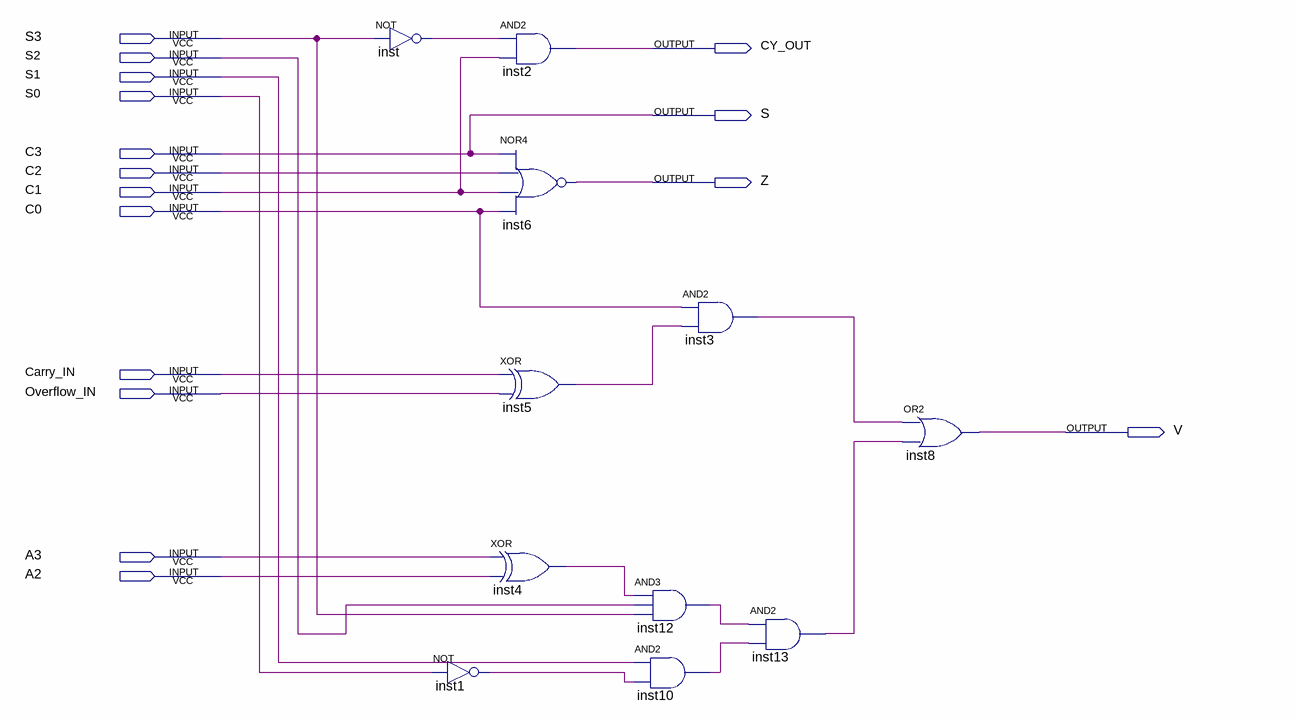
[diagram p0: schematic sheet]
// Quartus schematic Lab3.bdf as structural Verilog: 11 symbols, 16 pins
module Lab3 (
  input  S3,
  input  S2,
  input  S1,
  input  S0,
  input  C3,
  input  C2,
  input  C1,
  input  C0,
  input  Carry_IN,
  input  Overflow_IN,
  input  A3,
  input  A2,
  output CY_OUT,
  output S,
  output Z,
  output V
);

  wire inst1_out, inst3_out, inst4_out, inst5_out, inst10_out, inst12_out, inst13_out, inst_out;

  not inst (inst_out, S3);
  not inst1 (inst1_out, S0);
  and inst2 (CY_OUT, inst_out, C1);
  nor inst6 (Z, C3, C2, C1, C0);
  xor inst5 (inst5_out, Carry_IN, Overflow_IN);
  xor inst4 (inst4_out, A3, A2);
  and inst3 (inst3_out, C0, inst5_out);
  and inst12 (inst12_out, inst4_out, S2, S3);
  and inst10 (inst10_out, S1, inst1_out);
  and inst13 (inst13_out, inst12_out, inst10_out);
  or inst8 (V, inst3_out, inst13_out);

  assign S = C3;
endmodule
